# Altium schematic sheet Power_Supply.SchDoc
size A4; Organization: Altium Limited; Address1: L3, 12a Rodborough Rd; Address2: Frenchs Forest; Address3: NSW; Address4: Australia 2086
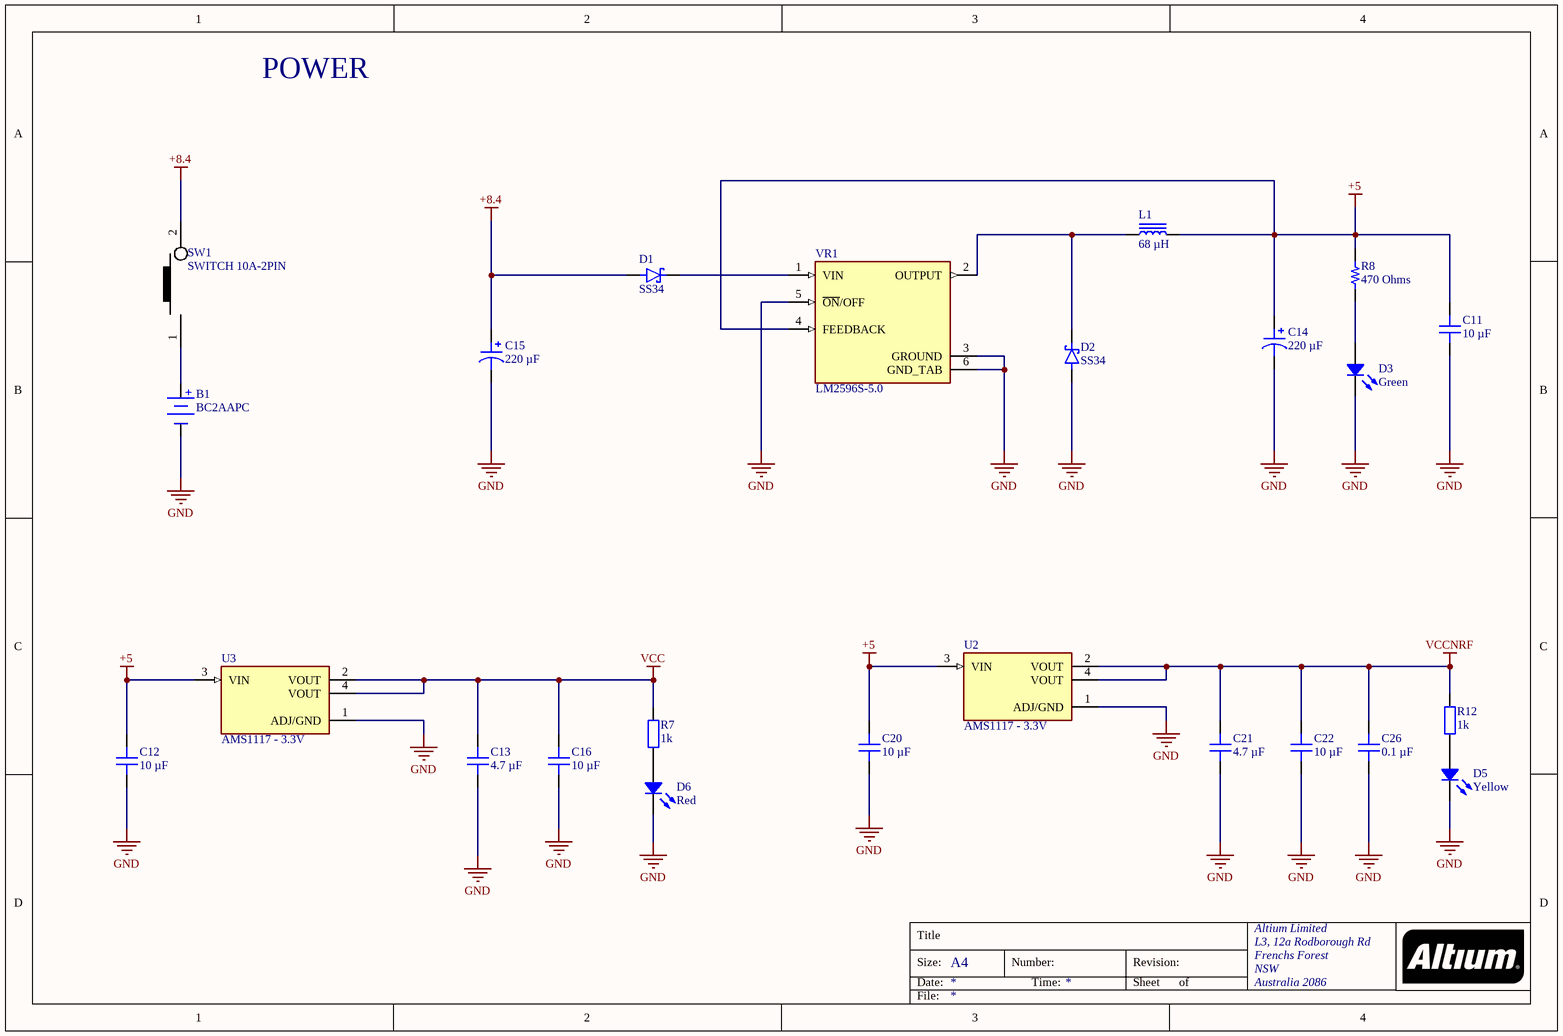
[diagram p0: Power_Supply.SchDoc]

## Parts
B1  BC2AAPC  [MPD BC2AAPC]
C11  10 µF  [CAP 0603_1608]
C12  10 µF  [CAP 0603_1608]
C13  4.7 µF  [CAP 0603_1608]
C14  220 µF  [CAP ALSMD 8.3MM H10.5MM]
C15  220 µF  [CAP ALSMD 8.3MM H10.5MM]
C16  10 µF  [CAP 0603_1608]
C20  10 µF  [CAP 0603_1608]
C21  4.7 µF  [CAP 0603_1608]
C22  10 µF  [CAP 0603_1608]
C26  0.1 µF  [CAP 0603_1608]
D1  SS34  [DIOM7959X265N]
D2  SS34  [DIOM7959X265N]
D3  Green  [LED 0402_1005 GREEN]
D5  Yellow  [LED 0402_1005 YELLOW]
D6  Red  [LED 0402_1005 RED]
L1  68 µH  [WURTH WE-PD 1210]
R7  1k  [tro smd 0603]
R8  470 Ohms  [RES 0603_1608]
R12  1k  [tro smd 0603]
SW1  SWITCH 10A-2PIN  [SW_2ARS_TH]
U2  AMS1117 - 3.3V  [SOT229P700X180-4N]
U3  AMS1117 - 3.3V  [SOT229P700X180-4N]
VR1  LM2596S-5.0  [TO170P1524X483-6N]

## Nets
+5: C11.2 C12.2 C14.1 C20.2 L1.2 R8.2 U2.3(VIN) U3.3(VIN) VR1.4(FEEDBACK)
+8.4: C15.1 D1.A SW1.2
GND: B1.2(-) C11.1 C12.1 C13.1 C14.2 C15.2 C16.1 C20.1 C21.1 C22.1 C26.1 D2.A D3.2 D5.2 D6.2 U2.1(ADJ/GND) U3.1(ADJ/GND) VR1.3(GROUND) VR1.5(~{ON}/OFF) VR1.6(GND_TAB)
VCC: C13.2 C16.2 R7.2 U3.2(VOUT) U3.4(VOUT)
VCCNRF: C21.2 C22.2 C26.2 R12.2 U2.2(VOUT) U2.4(VOUT)
NetB1_1: B1.1(+) SW1.1
NetD1_C: D1.C(K) VR1.1(VIN)
NetD2_C: D2.C(K) L1.1 VR1.2(OUTPUT)
NetD3_1: D3.1 R8.1
NetD5_1: D5.1 R12.1
NetD6_1: D6.1 R7.1

## Notes on the sheet
- POWER
- Title
- Size:
- Date:
- A4
- Number:
- Time:
- Revision:
- Sheet
- of
- File:

## Library data of the parts
B1 = BC2AAPC: BATTERY HOLDER AA 2 CELL PC PIN; Manufacturer: MPD (Memory Protection Devices); Battery Type, Function: Cylindrical, Holder; Number of Cells: 2; Style: Holder (Open); Part Number: BC2AAPC; Battery Cell Size: AA; ComponentLink1Description: Datasheet; ComponentLink1URL: //media.digikey.com/pdf/Data%20Sheets/Memory%20Protection%20PDFs/BC2AAPC.pdf; ComponentLink2Description: DigiKey Link; ComponentLink2URL: https://www.digikey.com/en/products/detail/mpd-memory-protection-devices/BC2AAPC/455777; Height Above Board: 0.591" (15.01mm); LastUpdated: 6/16/2022 8:47:25 AM; Lifecycle Status: Active; Minimum Order: 1; Mounting Type: PCB, Through Hole; Operating Temperature: -10°C ~ 100°C; Packaging: Bulk; PartId: 4; Part Status: Active; Price: 0.59; Series: -; Supplier 1: DigiKey; Supplier Part Number 1: BC2AAPC-ND; Termination Style: PC Pin
C11 = TMK107BBJ106MA-T: CAP CER 10UF 25V X5R 0603; manufacturer: Taiyo Yuden; Tolerance: ±20%; Part Number: TMK107BBJ106MA-T; Value: 10 µF; Applications: SMPS Filtering; Capacitance: 10 µF; componentlink1description: Datasheet; componentlink1url: https://ds.yuden.co.jp/TYCOMPAS/ut/detail?pn=TMK107BBJ106MA-T &u=M; componentlink2description: DigiKey Link; componentlink2url: https://www.digikey.com/en/products/detail/taiyo-yuden/TMK107BBJ106MA-T/7403921; Device Package: 0603 (1608 Metric); lastupdated: 2/9/2024 8:10:22 PM; Lifecycle Status: Active; Minimum Order: 1; Mounting Type: Surface Mount, MLCC; Operating Temperature: -55°C ~ 85°C; Package / Case: 0603 (1608 Metric); packaging: TapeAndReel; partid: 8967; Part Status: Active; price: 0.07; series: M; Size / Dimension: 0.063" L x 0.031" W (1.60mm x 0.80mm); Supplier 1: DigiKey; Supplier Part Number 1: 587-6023-1-ND; Temperature Coefficient: X5R; Thickness (Max): 0.039" (1.00mm); Voltage - Rated: 25V
C12 C16 C20 C22 = GRM188C81A106MA73D: CAP CER 10UF 10V X6S 0603; manufacturer: Murata Electronics; Tolerance: ±20%; Part Number: GRM188C81A106MA73D; Value: 10 µF; Applications: General Purpose; Capacitance: 10 µF; componentlink1description: Datasheet; componentlink1url: https://www.murata.com/~/media/webrenewal/support/library/catalog/products/capacitor/mlcc/c02e.ashx?la=en-us; componentlink2description: DigiKey Link; componentlink2url: https://www.digikey.com/en/products/detail/murata-electronics/GRM188C81A106MA73D/3900461; Device Package: 0603 (1608 Metric); lastupdated: 2/9/2024 8:10:30 PM; Lifecycle Status: Active; Minimum Order: 1; Mounting Type: Surface Mount, MLCC; Operating Temperature: -55°C ~ 105°C; Package / Case: 0603 (1608 Metric); packaging: TapeAndReel; partid: 2456; Part Status: Active; price: 0.04; series: GRM; Size / Dimension: 0.063" L x 0.031" W (1.60mm x 0.80mm); Supplier 1: DigiKey; Supplier Part Number 1: 490-7197-1-ND; Temperature Coefficient: X6S; Thickness (Max): 0.039" (1.00mm); Voltage - Rated: 10V
C13 C21 = LMK107BJ475MAHT: CAP CER 4.7UF 10V X5R 0603; manufacturer: Taiyo Yuden; Tolerance: ±20%; Part Number: LMK107BJ475MAHT; Value: 4.7 µF; Applications: Automotive; Capacitance: 4.7 µF; componentlink1description: Datasheet; componentlink1url: https://ds.yuden.co.jp/TYCOMPAS/ut/detail?pn=LMK107BJ475MAHT &u=M; componentlink2description: DigiKey Link; componentlink2url: https://www.digikey.com/en/products/detail/taiyo-yuden/LMK107BJ475MAHT/4970801; Device Package: 0603 (1608 Metric); lastupdated: 2/9/2024 8:10:27 PM; Lifecycle Status: Active; Minimum Order: 1; Mounting Type: Surface Mount, MLCC; Operating Temperature: -55°C ~ 85°C; Package / Case: 0603 (1608 Metric); packaging: TapeAndReel; partid: 4660; Part Status: Active; price: 0.02; Ratings: AEC-Q200; series: M; Size / Dimension: 0.063" L x 0.031" W (1.60mm x 0.80mm); Supplier 1: DigiKey; Supplier Part Number 1: 587-6291-1-ND; Temperature Coefficient: X5R; Thickness (Max): 0.035" (0.90mm); Voltage - Rated: 10V
C14 C15 = VZH221M1ETR-0810S: CAP ALUM 220UF 20% 25V SMD; manufacturer: SURGE; Impedance: 170 mOhms; Lifetime @ Temp.: 5000 Hrs @ 105°C; Polarization: Polar; Ripple Current @ High Frequency: 450 mA @ 100 kHz; Surface Mount Land Size: 0.327" L x 0.327" W (8.30mm x 8.30mm); Part Number: VZH221M1ETR-0810S; Applications: General Purpose; Capacitance: 220 µF; componentlink1description: Datasheet; componentlink1url: https://www.surgecomponents.com/pdf/VZH.pdf; componentlink2description: DigiKey Link; componentlink2url: https://www.digikey.com/en/products/detail/surge/VZH221M1ETR-0810S/12451632; Height - Seated (Max): 0.413" (10.50mm); lastupdated: 6/3/2024 8:15:42 PM; Lifecycle Status: Active; Minimum Order: 1; Mounting Type: Surface Mount; Operating Temperature: -55°C ~ 105°C; packaging: CutTape; partid: 28093; Part Status: Active; price: 0.25; series: VZH; Size / Dimension: 0.315" Dia (8.00mm); Supplier 1: DigiKey; Supplier Part Number 1: 4403-VZH221M1ETR-0810SCT-ND; Tolerance: ±20%; value: 220 µF; Voltage - Rated: 25 V
C26 = KGM15AR71C104MT: CAP CER 0.1UF 16V X7R 0603; manufacturer: KYOCERA AVX; Tolerance: ±20%; Part Number: KGM15AR71C104MT; Value: 0.1 µF; Applications: General Purpose; Capacitance: 0.1 µF; componentlink1description: Datasheet; componentlink1url: https://datasheets.kyocera-avx.com/X7RDielectric.pdf; componentlink2description: DigiKey Link; componentlink2url: https://www.digikey.com/en/products/detail/kyocera-avx/KGM15AR71C104MT/1116253; Device Package: 0603 (1608 Metric); lastupdated: 2/9/2024 8:09:12 PM; Lifecycle Status: Active; Minimum Order: 1; Mounting Type: Surface Mount, MLCC; Operating Temperature: -55°C ~ 125°C; Package / Case: 0603 (1608 Metric); packaging: TapeAndReel; partid: 53325; Part Status: Active; price: 0.01; series: KGM - X7R; Size / Dimension: 0.063" L x 0.032" W (1.60mm x 0.81mm); Supplier 1: DigiKey; Supplier Part Number 1: 478-KGM15AR71C104MTCT-ND; Temperature Coefficient: X7R; Thickness (Max): 0.035" (0.90mm); Voltage - Rated: 16V
D1 D2 = SS34: Diode Schottky 40 V 3A Surface Mount SMC (DO-214AB); MF: onsemi; SnapEDA_Link: https://www.snapeda.com/parts/SS34/Onsemi/view-part/?ref=snap; Package: SMC-2 ON Semiconductor; Value: *; MP: SS34; Check_prices: https://www.snapeda.com/parts/SS34/Onsemi/view-part/?ref=eda
D3 = XZVGR68W-3: LED GREEN CLEAR 0402 SMD; Manufacturer: SunLED; Configuration: Standard; Current - Test: 20mA; Lens Color: Colorless; Lens Size: 0.60mm x 0.50mm; Lens Style: Rectangle with Flat Top; Millicandela Rating: 34mcd; Viewing Angle: 120°; Voltage - Forward (Vf) (Typ): 2V; Wavelength - Dominant: 571nm; Wavelength - Peak: 572nm; Part Number: XZVGR68W-3; Color: Green; ComponentLink1Description: Datasheet; ComponentLink1URL: https://www.sunledusa.com/products/spec/XZVGR68W-3.pdf; ComponentLink2Description: DigiKey Link; ComponentLink2URL: https://www.digikey.com/en/products/detail/sunled/XZVGR68W-3/6615530; Device Package: 0402 (1005 Metric); Height (Max): 0.25mm; LastUpdated: 6/3/2024 7:58:14 PM; Lens Transparency: Clear; Lifecycle Status: Active; Minimum Order: 1; Mounting Type: Surface Mount; Package / Case: 0402 (1005 Metric); Packaging: TapeAndReel; PartId: 718; Part Status: Active; Price: 0.08; Series: -; Size / Dimension: 1.00mm L x 0.50mm W; Supplier 1: DigiKey; Supplier Part Number 1: 1497-1386-1-ND; Supplier Device Package: 0402; Value: Green
D5 = XZMYR68W-3: LED YELLOW CLEAR 0402 SMD; Manufacturer: SunLED; Configuration: Standard; Current - Test: 20mA; Lens Color: Colorless; Lens Size: 0.60mm x 0.50mm; Lens Style: Rectangle with Flat Top; Millicandela Rating: 98mcd; Viewing Angle: 120°; Voltage - Forward (Vf) (Typ): 2.05V; Wavelength - Dominant: 589nm; Wavelength - Peak: 591nm; Part Number: XZMYR68W-3; Color: Yellow; ComponentLink1Description: Datasheet; ComponentLink1URL: https://www.sunledusa.com/products/spec/XZMYR68W-3.pdf; ComponentLink2Description: DigiKey Link; ComponentLink2URL: https://www.digikey.com/en/products/detail/sunled/XZMYR68W-3/6615529; Device Package: 0402 (1005 Metric); Height (Max): 0.25mm; LastUpdated: 6/3/2024 8:00:47 PM; Lens Transparency: Clear; Lifecycle Status: Active; Minimum Order: 1; Mounting Type: Surface Mount; Package / Case: 0402 (1005 Metric); Packaging: TapeAndReel; PartId: 171; Part Status: Active; Price: 0.07; Series: -; Size / Dimension: 1.00mm L x 0.50mm W; Supplier 1: DigiKey; Supplier Part Number 1: 1497-1385-1-ND; Supplier Device Package: 0402; Value: Yellow
D6 = 150040RS73220: LED RED CLEAR 0402 SMD; Manufacturer: Würth Elektronik; Configuration: 0402; Current - Test: 20mA; Lens Color: Colorless; Lens Size: 1.00mm x 0.50mm; Lens Style: Rectangle with Flat Top; Millicandela Rating: 110mcd; Viewing Angle: 120°; Voltage - Forward (Vf) (Typ): 2V; Wavelength - Dominant: 624nm; Wavelength - Peak: 632nm; Part Number: 150040RS73220; Color: Red; ComponentLink2Description: DigiKey Link; ComponentLink2URL: https://www.digikey.com/en/products/detail/würth-elektronik/150040RS73220/9857945; Device Package: 0402 (1005 Metric); Height (Max): 0.35mm; LastUpdated: 6/3/2024 7:59:17 PM; Lens Transparency: Clear; Lifecycle Status: Active; Minimum Order: 1; Mounting Type: Surface Mount; Package / Case: 0402 (1005 Metric); Packaging: TapeAndReel; PartId: 512; Part Status: Active; Price: 0.29; Series: WL-SMCC; Size / Dimension: 1.00mm L x 0.50mm W; Supplier 1: DigiKey; Supplier Part Number 1: 732-13422-1-ND; Supplier Device Package: 0402; Value: Red
L1 = 7447709680: FIXED IND 68UH 3.2A 89 MOHM SMD; Manufacturer: Würth Elektronik; Current - Saturation: 3.6A; DC Resistance (DCR): 89mOhm Max; Frequency - Self Resonant: 5.5MHz; Inductance Frequency - Test: 1 kHz; Material - Core: Ferrite; Shielding: Shielded; Tolerance: ±20%; Type: Drum Core, Wirewound; Part Number: 7447709680; ComponentLink1Description: Datasheet; ComponentLink1URL: https://katalog.we-online.de/pbs/datasheet/7447709680.pdf; ComponentLink2Description: DigiKey Link; ComponentLink2URL: https://www.digikey.com/en/products/detail/würth-elektronik/7447709680/1638652; Current Rating (Amps): 3.2 A; Device Package: Nonstandard; Height - Seated (Max): 0.394" (10.00mm); Inductance: 68 µH; LastUpdated: 6/3/2024 8:26:17 PM; Lifecycle Status: Active; Minimum Order: 1; Mounting Type: Surface Mount; Operating Temperature: -40°C ~ 125°C; Package / Case: Nonstandard; Packaging: TapeAndReel; PartId: 5691; Part Status: Active; Price: 1.48; Ratings: AEC-Q200; Series: WE-PD; Size / Dimension: 0.472" L x 0.472" W (12.00mm x 12.00mm); Supplier 1: DigiKey; Supplier Part Number 1: 732-1247-1-ND; Supplier Device Package: 1212; Value: 68 µH
R7 R12 = Tro 0603 1% 1k: Dán; So_Chan: 2; Don_Vi: Con; Ten_Linh_Kien: Trở 0603 1% 1k; Ma_Hang: MH006334; Chung_Loai: Dán; Kieu_Chan: *
R8 = RN73R1JTTD4700B25: RES 470 OHM 0.1% 1/10W 0603; Manufacturer: KOA Speer Electronics, Inc.; Power (Watts): 0.1W, 1/10W; Temperature Coefficient: ±25ppm/°C; Part Number: RN73R1JTTD4700B25; Value: 470 Ohms; ComponentLink1Description: Datasheet; ComponentLink1URL: https://media.digikey.com/pdf/Data%20Sheets/KOA%20Speer/RN73R_Type_DS.pdf; ComponentLink2Description: DigiKey Link; ComponentLink2URL: https://www.digikey.com/en/products/detail/koa-speer-electronics-inc/RN73R1JTTD4700B25/10017891; Composition: Thin Film; Device Package: 0603 (1608 Metric); Features: Automotive AEC-Q200, Moisture Resistant; Height - Seated (Max): 0.022" (0.55mm); LastUpdated: 2/9/2024 8:40:55 PM; Lifecycle Status: Active; Minimum Order: 1; Number of Terminations: 2; Operating Temperature: -55°C ~ 155°C; Package / Case: 0603 (1608 Metric); Packaging: TapeAndReel; PartId: 71186; Part Status: Active; Price: 0.05; Ratings: AEC-Q200; Resistance: 470 Ohms; Series: RN73R; Size / Dimension: 0.063" L x 0.031" W (1.60mm x 0.80mm); Supplier 1: DigiKey; Supplier Part Number 1: 2019-RN73R1JTTD4700B25CT-ND; Supplier Device Package: 0603; Tolerance: ±0.1%
SW1 = SW1_RS-471005264153-TH: Rocker Switch SPST 16A (AC), 10A (DC) 250V Panel Mount, Snap-In; Manufacturer: Würth Elektronik; Alternate Part Number-1: NA; Manufacturer Part Number: 471005264153; Case/Package: TH; Supplier-1: Würth Elektronik; Supplier Part Number-1: 471005264153
U2 U3 = AMS1117: 1A LOW DROPOUT VOLTAGE REGULATOR SOT-223; MF: Advanced Monolithic Systems; Price: None; Availability: Not in stock; Package: SOT-223 Seeed Technology; MP: AMS1117; Value: *; SnapEDA_Link: https://www.snapeda.com/parts/AMS1117/Advanced+Monolithic+Systems/view-part/?ref=snap; Check_prices: https://www.snapeda.com/parts/AMS1117/Advanced+Monolithic+Systems/view-part/?ref=eda
VR1 = LM2596S-5.0: SIMPLE SWITCHER&reg; 4.5V to 40V, 3A Low Component Count Step-Down Regulator; MP: LM2596S-5.0/NOPB; MF: Texas Instruments; Price: None; Availability: In Stock; Package: TO-263-5 Texas Instruments; SnapEDA_Link: https://www.snapeda.com/parts/LM2596S-5.0/NOPB/Texas+Instruments/view-part/?ref=snap; Check_prices: https://www.snapeda.com/parts/LM2596S-5.0/NOPB/Texas+Instruments/view-part/?ref=eda; Value: *; Purchase-URL: https://pricing.snapeda.com/search/part/LM2596S-5.0/NOPB/?ref=eda